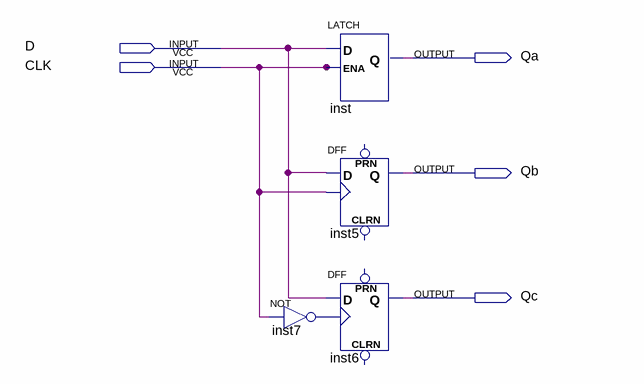
[diagram p0: schematic sheet]
// Quartus schematic step_3.bdf as structural Verilog: 4 symbols, 5 pins
module step_3 (
  input  D,
  input  CLK,
  output Qa,
  output Qb,
  output Qc
);

  wire inst7_out;

  not inst7 (inst7_out, CLK);
  LATCH inst (.D(D), .ENA(CLK), .Q(Qa));
  DFF inst5 (.CLK(CLK), .D(D), .Q(Qb));  // open: CLRN, PRN
  DFF inst6 (.CLK(inst7_out), .D(D), .Q(Qc));  // open: CLRN, PRN
endmodule
